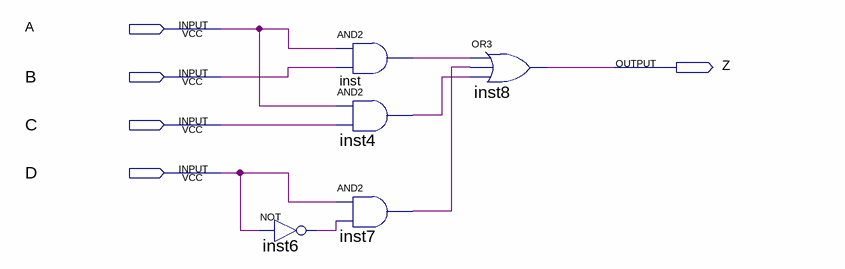
[diagram p0: schematic sheet]
// Quartus schematic decoder10.bdf as structural Verilog: 5 symbols, 5 pins
module decoder10 (
  input  A,
  input  B,
  input  C,
  input  D,
  output Z
);

  wire inst4_out, inst6_out, inst7_out, inst_out;

  not inst6 (inst6_out, D);
  and inst (inst_out, A, B);
  and inst4 (inst4_out, A, C);
  and inst7 (inst7_out, D, inst6_out);
  or inst8 (Z, inst_out, inst7_out, inst4_out);
endmodule
